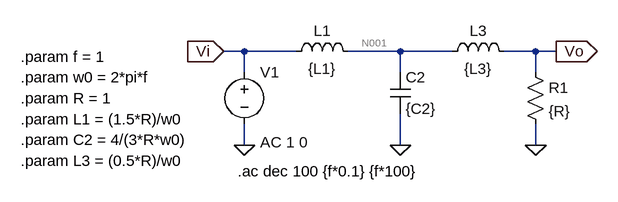
[diagram p0: schematic TS6_2.asc]
TS6_2.asc, the LTspice schematic file:
Version 4
SHEET 1 880 680
WIRE 16 80 -16 80
WIRE 96 80 16 80
WIRE 256 80 176 80
WIRE 336 80 256 80
WIRE 464 80 416 80
WIRE 496 80 464 80
WIRE 16 112 16 80
WIRE 256 112 256 80
WIRE 464 112 464 80
WIRE 16 224 16 192
WIRE 256 224 256 176
WIRE 464 224 464 192
FLAG 16 224 0
FLAG 256 224 0
FLAG 464 224 0
FLAG -16 80 Vi
IOPIN -16 80 In
FLAG 496 80 Vo
IOPIN 496 80 Out
SYMBOL voltage 16 96 R0
WINDOW 123 24 124 Left 2
WINDOW 39 0 0 Left 0
SYMATTR InstName V1
SYMATTR Value ""
SYMATTR Value2 AC 1 0
SYMBOL ind 80 96 R270
WINDOW 0 32 56 VTop 2
WINDOW 3 5 56 VBottom 2
SYMATTR InstName L1
SYMATTR Value {L1}
SYMBOL ind 320 96 R270
WINDOW 0 32 56 VTop 2
WINDOW 3 5 56 VBottom 2
SYMATTR InstName L3
SYMATTR Value {L3}
SYMBOL res 448 96 R0
SYMATTR InstName R1
SYMATTR Value {R}
SYMBOL cap 240 112 R0
SYMATTR InstName C2
SYMATTR Value {C2}
TEXT 6 264 Left 2 !.ac dec 100 {f*0.1} {f*100}
TEXT -328 88 Left 2 !.param f = 1
TEXT -328 120 Left 2 !.param w0 = 2*pi*f
TEXT -328 152 Left 2 !.param R = 1
TEXT -328 184 Left 2 !.param L1 = (1.5*R)/w0
TEXT -328 216 Left 2 !.param C2 = 4/(3*R*w0)
TEXT -328 248 Left 2 !.param L3 = (0.5*R)/w0

The netlist it stands for:
* TS6_2.asc
V1 Vi 0 AC 1 0
L1 Vi N001 {L1}
L3 N001 Vo {L3}
R1 Vo 0 {R}
C2 N001 0 {C2}
.ac dec 100 {f*0.1} {f*100}
.param f = 1
.param w0 = 2*pi*f
.param R = 1
.param L1 = (1.5*R)/w0
.param C2 = 4/(3*R*w0)
.param L3 = (0.5*R)/w0
.backanno
.end

* Results of the author's LTspice run, read from the files saved beside the schematic
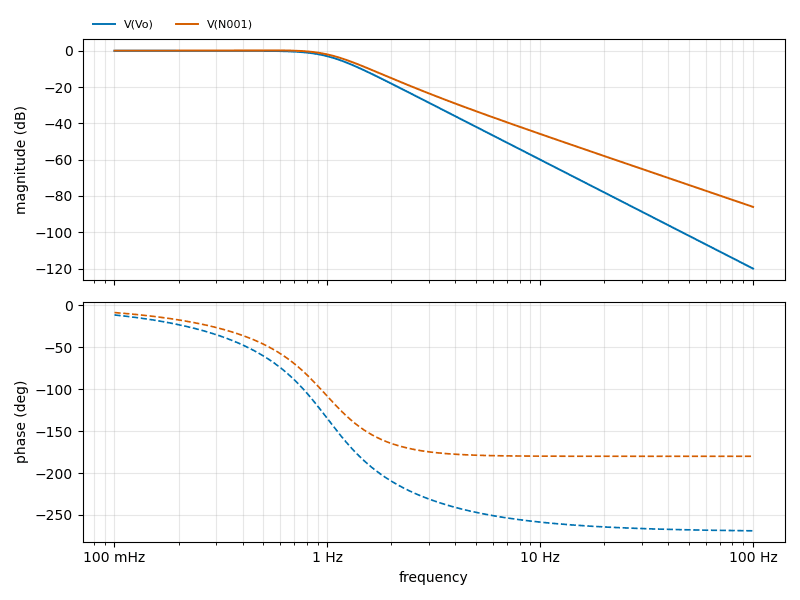
[diagram p1: AC Analysis of TS6_2.asc, plotted from the saved traces]
* AC Analysis, 1 run:
*   V(Vo): -0.02 dB at 100 mHz, -120.00 dB at 100 Hz, peak -0.02 dB at 223.9 mHz, 3 dB below the peak at 1.001 Hz
*   V(N001): 0.00 dB at 100 mHz, -86.02 dB at 100 Hz, peak 0.20 dB at 537 mHz, 3 dB below the peak at 1.064 Hz